# Altium schematic sheet [2] RK3399_SDRAM.SchDoc: RK3399 connection with SDRAM
size B; DocumentNumber: I; Revision: 01; SheetNumber: 2; SheetTotal: 19
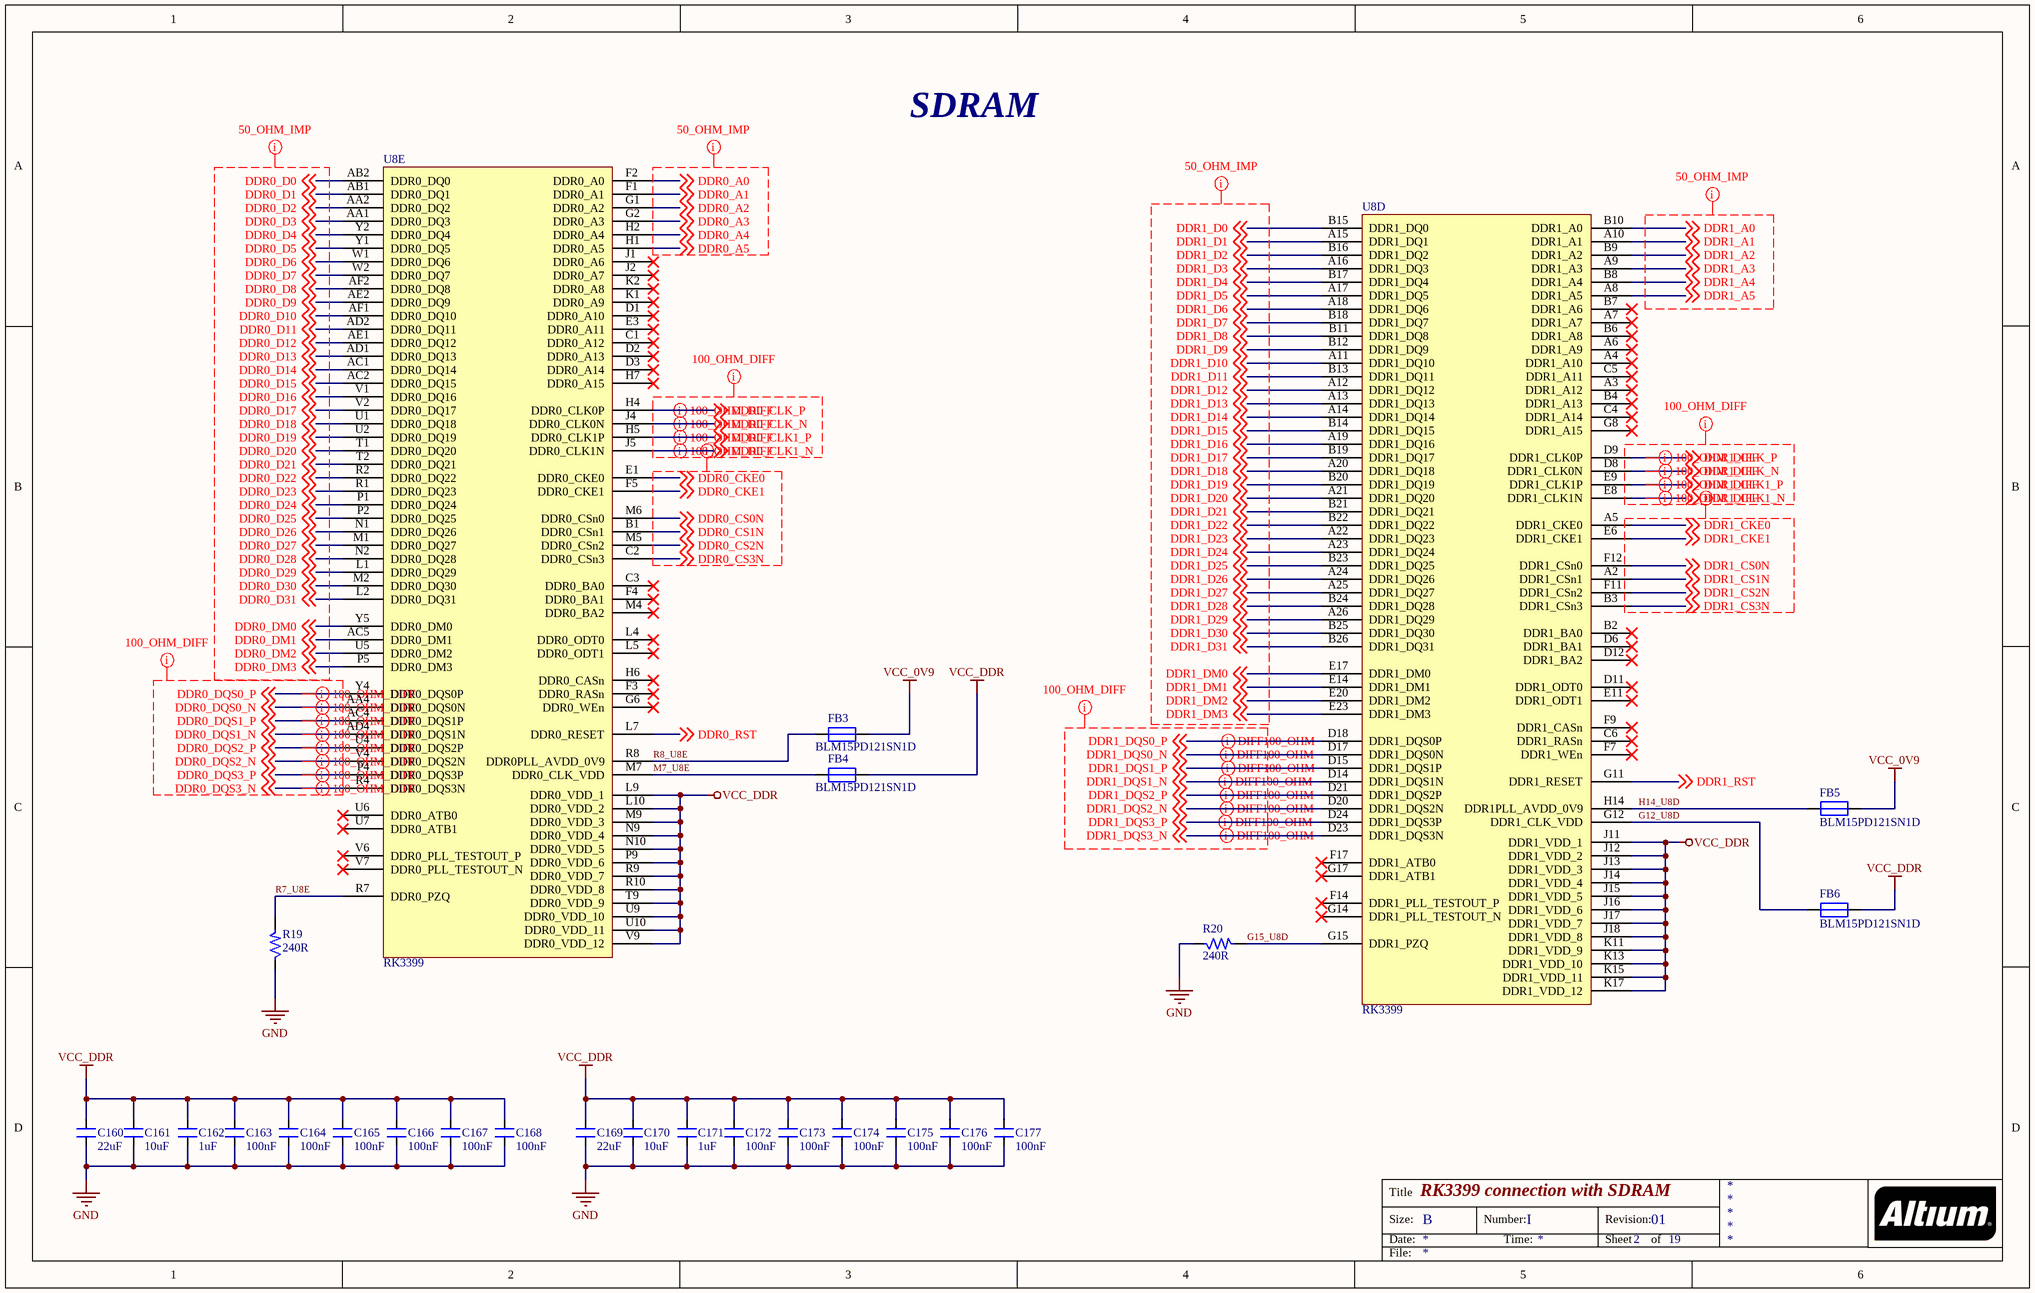
[diagram p0: [2] RK3399_SDRAM.SchDoc]

## Parts
C160  22uF  [CAP_0402]
C161  10uF  [CAP_0402]
C162  1uF  [CAP_0402]
C163  100nF  [CAP_0402]
C164  100nF  [CAP_0402]
C165  100nF  [CAP_0402]
C166  100nF  [CAP_0402]
C167  100nF  [CAP_0402]
C168  100nF  [CAP_0402]
C169  22uF  [CAP_0402]
C170  10uF  [CAP_0402]
C171  1uF  [CAP_0402]
C172  100nF  [CAP_0402]
C173  100nF  [CAP_0402]
C174  100nF  [CAP_0402]
C175  100nF  [CAP_0402]
C176  100nF  [CAP_0402]
C177  100nF  [CAP_0402]
FB3  BLM15PD121SN1D  [RES_0402]
FB4  BLM15PD121SN1D  [RES_0402]
FB5  BLM15PD121SN1D  [RES_0402]
FB6  BLM15PD121SN1D  [RES_0402]
R19  240R  [RES_0201]
R20  240R  [RES_0201]
U8  RK3399  [FBGA828_23_826X826]  (parts D,E of 24)

## Nets
GND: C160.1 C161.1 C162.1 C163.1 C164.1 C165.1 C166.1 C167.1 C168.1 C169.1 C170.1 C171.1 C172.1 C173.1 C174.1 C175.1 C176.1 C177.1 R19.1 R20.1
VCC_0V9: FB3.2 FB5.2
VCC_DDR: C160.2 C161.2 C162.2 C163.2 C164.2 C165.2 C166.2 C167.2 C168.2 C169.2 C170.2 C171.2 C172.2 C173.2 C174.2 C175.2 C176.2 C177.2 FB4.2 FB6.2 U8.J11(DDR1_VDD_1) U8.J12(DDR1_VDD_2) U8.J13(DDR1_VDD_3) U8.J14(DDR1_VDD_4) U8.J15(DDR1_VDD_5) U8.J16(DDR1_VDD_6) U8.J17(DDR1_VDD_7) U8.J18(DDR1_VDD_8) U8.K11(DDR1_VDD_9) U8.K13(DDR1_VDD_10) U8.K15(DDR1_VDD_11) U8.K17(DDR1_VDD_12) U8.L9(DDR0_VDD_1) U8.L10(DDR0_VDD_2) U8.M9(DDR0_VDD_3) U8.N9(DDR0_VDD_4) U8.N10(DDR0_VDD_5) U8.P9(DDR0_VDD_6) U8.R9(DDR0_VDD_7) U8.R10(DDR0_VDD_8) U8.T9(DDR0_VDD_9) U8.U9(DDR0_VDD_10) U8.U10(DDR0_VDD_11) U8.V9(DDR0_VDD_12)
DDR0_A0: U8.F2(DDR0_A0) ; off-sheet DDR0_A0
DDR0_A1: U8.F1(DDR0_A1) ; off-sheet DDR0_A1
DDR0_A2: U8.G1(DDR0_A2) ; off-sheet DDR0_A2
DDR0_A3: U8.G2(DDR0_A3) ; off-sheet DDR0_A3
DDR0_A4: U8.H2(DDR0_A4) ; off-sheet DDR0_A4
DDR0_A5: U8.H1(DDR0_A5) ; off-sheet DDR0_A5
DDR0_CKE0: U8.E1(DDR0_CKE0) ; off-sheet DDR0_CKE0
DDR0_CKE1: U8.F5(DDR0_CKE1) ; off-sheet DDR0_CKE1
DDR0_CLK1_N: U8.J5(DDR0_CLK1N) ; off-sheet DDR0_CLK1_N
DDR0_CLK1_P: U8.H5(DDR0_CLK1P) ; off-sheet DDR0_CLK1_P
DDR0_CLK_N: U8.J4(DDR0_CLK0N) ; off-sheet DDR0_CLK_N
DDR0_CLK_P: U8.H4(DDR0_CLK0P) ; off-sheet DDR0_CLK_P
DDR0_CS0N: U8.M6(DDR0_CSn0) ; off-sheet DDR0_CS0N
DDR0_CS1N: U8.B1(DDR0_CSn1) ; off-sheet DDR0_CS1N
DDR0_CS2N: U8.M5(DDR0_CSn2) ; off-sheet DDR0_CS2N
DDR0_CS3N: U8.C2(DDR0_CSn3) ; off-sheet DDR0_CS3N
DDR0_D0: U8.AB2(DDR0_DQ0) ; off-sheet DDR0_D0
DDR0_D1: U8.AB1(DDR0_DQ1) ; off-sheet DDR0_D1
DDR0_D2: U8.AA2(DDR0_DQ2) ; off-sheet DDR0_D2
DDR0_D3: U8.AA1(DDR0_DQ3) ; off-sheet DDR0_D3
DDR0_D4: U8.Y2(DDR0_DQ4) ; off-sheet DDR0_D4
DDR0_D5: U8.Y1(DDR0_DQ5) ; off-sheet DDR0_D5
DDR0_D6: U8.W1(DDR0_DQ6) ; off-sheet DDR0_D6
DDR0_D7: U8.W2(DDR0_DQ7) ; off-sheet DDR0_D7
DDR0_D8: U8.AF2(DDR0_DQ8) ; off-sheet DDR0_D8
DDR0_D9: U8.AE2(DDR0_DQ9) ; off-sheet DDR0_D9
DDR0_D10: U8.AF1(DDR0_DQ10) ; off-sheet DDR0_D10
DDR0_D11: U8.AD2(DDR0_DQ11) ; off-sheet DDR0_D11
DDR0_D12: U8.AE1(DDR0_DQ12) ; off-sheet DDR0_D12
DDR0_D13: U8.AD1(DDR0_DQ13) ; off-sheet DDR0_D13
DDR0_D14: U8.AC1(DDR0_DQ14) ; off-sheet DDR0_D14
DDR0_D15: U8.AC2(DDR0_DQ15) ; off-sheet DDR0_D15
DDR0_D16: U8.V1(DDR0_DQ16) ; off-sheet DDR0_D16
DDR0_D17: U8.V2(DDR0_DQ17) ; off-sheet DDR0_D17
DDR0_D18: U8.U1(DDR0_DQ18) ; off-sheet DDR0_D18
DDR0_D19: U8.U2(DDR0_DQ19) ; off-sheet DDR0_D19
DDR0_D20: U8.T1(DDR0_DQ20) ; off-sheet DDR0_D20
DDR0_D21: U8.T2(DDR0_DQ21) ; off-sheet DDR0_D21
DDR0_D22: U8.R2(DDR0_DQ22) ; off-sheet DDR0_D22
DDR0_D23: U8.R1(DDR0_DQ23) ; off-sheet DDR0_D23
DDR0_D24: U8.P1(DDR0_DQ24) ; off-sheet DDR0_D24
DDR0_D25: U8.P2(DDR0_DQ25) ; off-sheet DDR0_D25
DDR0_D26: U8.N1(DDR0_DQ26) ; off-sheet DDR0_D26
DDR0_D27: U8.M1(DDR0_DQ27) ; off-sheet DDR0_D27
DDR0_D28: U8.N2(DDR0_DQ28) ; off-sheet DDR0_D28
DDR0_D29: U8.L1(DDR0_DQ29) ; off-sheet DDR0_D29
DDR0_D30: U8.M2(DDR0_DQ30) ; off-sheet DDR0_D30
DDR0_D31: U8.L2(DDR0_DQ31) ; off-sheet DDR0_D31
DDR0_DM0: U8.Y5(DDR0_DM0) ; off-sheet DDR0_DM0
DDR0_DM1: U8.AC5(DDR0_DM1) ; off-sheet DDR0_DM1
DDR0_DM2: U8.U5(DDR0_DM2) ; off-sheet DDR0_DM2
DDR0_DM3: U8.P5(DDR0_DM3) ; off-sheet DDR0_DM3
DDR0_DQS0_N: U8.AA4(DDR0_DQS0N) ; off-sheet DDR0_DQS0_N
DDR0_DQS0_P: U8.Y4(DDR0_DQS0P) ; off-sheet DDR0_DQS0_P
DDR0_DQS1_N: U8.AD4(DDR0_DQS1N) ; off-sheet DDR0_DQS1_N
DDR0_DQS1_P: U8.AC4(DDR0_DQS1P) ; off-sheet DDR0_DQS1_P
DDR0_DQS2_N: U8.V4(DDR0_DQS2N) ; off-sheet DDR0_DQS2_N
DDR0_DQS2_P: U8.U4(DDR0_DQS2P) ; off-sheet DDR0_DQS2_P
DDR0_DQS3_N: U8.R4(DDR0_DQS3N) ; off-sheet DDR0_DQS3_N
DDR0_DQS3_P: U8.P4(DDR0_DQS3P) ; off-sheet DDR0_DQS3_P
DDR0_RST: U8.L7(DDR0_RESET) ; off-sheet DDR0_RST
DDR1_A0: U8.B10(DDR1_A0) ; off-sheet DDR1_A0
DDR1_A1: U8.A10(DDR1_A1) ; off-sheet DDR1_A1
DDR1_A2: U8.B9(DDR1_A2) ; off-sheet DDR1_A2
DDR1_A3: U8.A9(DDR1_A3) ; off-sheet DDR1_A3
DDR1_A4: U8.B8(DDR1_A4) ; off-sheet DDR1_A4
DDR1_A5: U8.A8(DDR1_A5) ; off-sheet DDR1_A5
DDR1_CKE0: U8.A5(DDR1_CKE0) ; off-sheet DDR1_CKE0
DDR1_CKE1: U8.E6(DDR1_CKE1) ; off-sheet DDR1_CKE1
DDR1_CLK1_N: U8.E8(DDR1_CLK1N) ; off-sheet DDR1_CLK1_N
DDR1_CLK1_P: U8.E9(DDR1_CLK1P) ; off-sheet DDR1_CLK1_P
DDR1_CLK_N: U8.D8(DDR1_CLK0N) ; off-sheet DDR1_CLK_N
DDR1_CLK_P: U8.D9(DDR1_CLK0P) ; off-sheet DDR1_CLK_P
DDR1_CS0N: U8.F12(DDR1_CSn0) ; off-sheet DDR1_CS0N
DDR1_CS1N: U8.A2(DDR1_CSn1) ; off-sheet DDR1_CS1N
DDR1_CS2N: U8.F11(DDR1_CSn2) ; off-sheet DDR1_CS2N
DDR1_CS3N: U8.B3(DDR1_CSn3) ; off-sheet DDR1_CS3N
DDR1_D0: U8.B15(DDR1_DQ0) ; off-sheet DDR1_D0
DDR1_D1: U8.A15(DDR1_DQ1) ; off-sheet DDR1_D1
DDR1_D2: U8.B16(DDR1_DQ2) ; off-sheet DDR1_D2
DDR1_D3: U8.A16(DDR1_DQ3) ; off-sheet DDR1_D3
DDR1_D4: U8.B17(DDR1_DQ4) ; off-sheet DDR1_D4
DDR1_D5: U8.A17(DDR1_DQ5) ; off-sheet DDR1_D5
DDR1_D6: U8.A18(DDR1_DQ6) ; off-sheet DDR1_D6
DDR1_D7: U8.B18(DDR1_DQ7) ; off-sheet DDR1_D7
DDR1_D8: U8.B11(DDR1_DQ8) ; off-sheet DDR1_D8
DDR1_D9: U8.B12(DDR1_DQ9) ; off-sheet DDR1_D9
DDR1_D10: U8.A11(DDR1_DQ10) ; off-sheet DDR1_D10
DDR1_D11: U8.B13(DDR1_DQ11) ; off-sheet DDR1_D11
DDR1_D12: U8.A12(DDR1_DQ12) ; off-sheet DDR1_D12
DDR1_D13: U8.A13(DDR1_DQ13) ; off-sheet DDR1_D13
DDR1_D14: U8.A14(DDR1_DQ14) ; off-sheet DDR1_D14
DDR1_D15: U8.B14(DDR1_DQ15) ; off-sheet DDR1_D15
DDR1_D16: U8.A19(DDR1_DQ16) ; off-sheet DDR1_D16
DDR1_D17: U8.B19(DDR1_DQ17) ; off-sheet DDR1_D17
DDR1_D18: U8.A20(DDR1_DQ18) ; off-sheet DDR1_D18
DDR1_D19: U8.B20(DDR1_DQ19) ; off-sheet DDR1_D19
DDR1_D20: U8.A21(DDR1_DQ20) ; off-sheet DDR1_D20
DDR1_D21: U8.B21(DDR1_DQ21) ; off-sheet DDR1_D21
DDR1_D22: U8.B22(DDR1_DQ22) ; off-sheet DDR1_D22
DDR1_D23: U8.A22(DDR1_DQ23) ; off-sheet DDR1_D23
DDR1_D24: U8.A23(DDR1_DQ24) ; off-sheet DDR1_D24
DDR1_D25: U8.B23(DDR1_DQ25) ; off-sheet DDR1_D25
DDR1_D26: U8.A24(DDR1_DQ26) ; off-sheet DDR1_D26
DDR1_D27: U8.A25(DDR1_DQ27) ; off-sheet DDR1_D27
DDR1_D28: U8.B24(DDR1_DQ28) ; off-sheet DDR1_D28
DDR1_D29: U8.A26(DDR1_DQ29) ; off-sheet DDR1_D29
DDR1_D30: U8.B25(DDR1_DQ30) ; off-sheet DDR1_D30
DDR1_D31: U8.B26(DDR1_DQ31) ; off-sheet DDR1_D31
DDR1_DM0: U8.E17(DDR1_DM0) ; off-sheet DDR1_DM0
DDR1_DM1: U8.E14(DDR1_DM1) ; off-sheet DDR1_DM1
DDR1_DM2: U8.E20(DDR1_DM2) ; off-sheet DDR1_DM2
DDR1_DM3: U8.E23(DDR1_DM3) ; off-sheet DDR1_DM3
DDR1_DQS0_N: U8.D17(DDR1_DQS0N) ; off-sheet DDR1_DQS0_N
DDR1_DQS0_P: U8.D18(DDR1_DQS0P) ; off-sheet DDR1_DQS0_P
DDR1_DQS1_N: U8.D14(DDR1_DQS1N) ; off-sheet DDR1_DQS1_N
DDR1_DQS1_P: U8.D15(DDR1_DQS1P) ; off-sheet DDR1_DQS1_P
DDR1_DQS2_N: U8.D20(DDR1_DQS2N) ; off-sheet DDR1_DQS2_N
DDR1_DQS2_P: U8.D21(DDR1_DQS2P) ; off-sheet DDR1_DQS2_P
DDR1_DQS3_N: U8.D23(DDR1_DQS3N) ; off-sheet DDR1_DQS3_N
DDR1_DQS3_P: U8.D24(DDR1_DQS3P) ; off-sheet DDR1_DQS3_P
DDR1_RST: U8.G11(DDR1_RESET) ; off-sheet DDR1_RST
G12_U8D: FB6.1 U8.G12(DDR1_CLK_VDD)
G15_U8D: R20.2 U8.G15(DDR1_PZQ)
H14_U8D: FB5.1 U8.H14(DDR1PLL_AVDD_0V9)
M7_U8E: FB4.1 U8.M7(DDR0_CLK_VDD)
R7_U8E: R19.2 U8.R7(DDR0_PZQ)
R8_U8E: FB3.1 U8.R8(DDR0PLL_AVDD_0V9)

Not connected (* = marked no-connect by the designer): U8 A3(DDR1_A12)* A4(DDR1_A10)* A6(DDR1_A9)* A7(DDR1_A7)* B2(DDR1_BA0)* B4(DDR1_A13)* B6(DDR1_A8)* B7(DDR1_A6)* C1(DDR0_A12)* C3(DDR0_BA0)* C4(DDR1_A14)* C5(DDR1_A11)* C6(DDR1_RASn)* D1(DDR0_A10)* D2(DDR0_A13)* D3(DDR0_A14)* D6(DDR1_BA1)* D11(DDR1_ODT0)* D12(DDR1_BA2)* E3(DDR0_A11)* E11(DDR1_ODT1)* F3(DDR0_RASn)* F4(DDR0_BA1)* F7(DDR1_WEn)* F9(DDR1_CASn)* F14(DDR1_PLL_TESTOUT_P)* F17(DDR1_ATB0)* G6(DDR0_WEn)* G8(DDR1_A15)* G14(DDR1_PLL_TESTOUT_N)* G17(DDR1_ATB1)* H6(DDR0_CASn)* H7(DDR0_A15)* J1(DDR0_A6)* J2(DDR0_A7)* K1(DDR0_A9)* K2(DDR0_A8)* L4(DDR0_ODT0)* L5(DDR0_ODT1)* M4(DDR0_BA2)* U6(DDR0_ATB0)* U7(DDR0_ATB1)* V6(DDR0_PLL_TESTOUT_P)* V7(DDR0_PLL_TESTOUT_N)*

## Layout directives
net class 50_OHM_IMP: DDR1_D0, DDR1_D1, DDR1_D2, DDR1_D3, DDR1_D4, DDR1_D5, DDR1_D6, DDR1_D7, DDR1_D8, DDR1_D9, DDR1_D10, DDR1_D11, DDR1_D12, DDR1_D13, DDR1_D14, DDR1_D15, DDR1_D16, DDR1_D17, DDR1_D18, DDR1_D19, DDR1_D20, DDR1_D21, DDR1_D22, DDR1_D23, DDR1_D24, DDR1_D25, DDR1_D26, DDR1_D27, DDR1_D28, DDR1_D29, DDR1_D30, DDR1_D31, DDR1_DM0, DDR1_DM1, DDR1_DM2, DDR1_DM3
differential pair; differential pair class DIIF_100_OHM: DDR1_DQS0_N, DDR1_DQS0_P, DDR1_DQS1_N, DDR1_DQS1_P, DDR1_DQS2_N, DDR1_DQS2_P, DDR1_DQS3_N, DDR1_DQS3_P
mark named 50_OHM_IMP: DDR0_A0, DDR0_A1, DDR0_A2, DDR0_A3, DDR0_A4, DDR0_A5, DDR0_CKE0, DDR0_CKE1, DDR0_CS0N, DDR0_CS1N, DDR0_CS2N, DDR0_CS3N, DDR0_D0, DDR0_D1, DDR0_D2, DDR0_D3, DDR0_D4, DDR0_D5, DDR0_D6, DDR0_D7, DDR0_D8, DDR0_D9, DDR0_D10, DDR0_D11, DDR0_D12, DDR0_D13, DDR0_D14, DDR0_D15, DDR0_D16, DDR0_D17, DDR0_D18, DDR0_D19, DDR0_D20, DDR0_D21, DDR0_D22, DDR0_D23, DDR0_D24, DDR0_D25, DDR0_D26, DDR0_D27, DDR0_D28, DDR0_D29, DDR0_D30, DDR0_D31, DDR0_DM0, DDR0_DM1, DDR0_DM2, DDR0_DM3, DDR1_A0, DDR1_A1, DDR1_A2, DDR1_A3, DDR1_A4, DDR1_A5, DDR1_CKE0, DDR1_CKE1, DDR1_CS0N, DDR1_CS1N, DDR1_CS2N, DDR1_CS3N
differential pair: DDR0_CLK1_N, DDR0_CLK1_P, DDR0_CLK_N, DDR0_CLK_P, DDR0_DQS0_N, DDR0_DQS0_P, DDR0_DQS1_N, DDR0_DQS1_P, DDR0_DQS2_N, DDR0_DQS2_P, DDR0_DQS3_N, DDR0_DQS3_P, DDR1_CLK1_N, DDR1_CLK1_P, DDR1_CLK_N, DDR1_CLK_P
mark named 100_OHM_DIFF: DDR0_CLK1_N, DDR0_CLK1_P, DDR0_CLK_N, DDR0_CLK_P, DDR0_DQS0_N, DDR0_DQS0_P, DDR0_DQS1_N, DDR0_DQS1_P, DDR0_DQS2_N, DDR0_DQS2_P, DDR0_DQS3_N, DDR0_DQS3_P, DDR1_CLK1_N, DDR1_CLK1_P, DDR1_CLK_N, DDR1_CLK_P, DDR1_DQS0_N, DDR1_DQS0_P, DDR1_DQS1_N, DDR1_DQS1_P, DDR1_DQS2_N, DDR1_DQS2_P, DDR1_DQS3_N, DDR1_DQS3_P

## Notes on the sheet
- SDRAM
- Title
- Size:
- Date:
- B
- Number:
- Time:
- Revision:
- Sheet
- of
- File:

## Library data of the parts
C160 C169 = CAP_22uF-6.3V-20%-0402: 22µF ±20% 6.3V Ceramic Capacitor X5R 0402 (1005 Metric) /; Manufacturer: Murata Electronics; Manufacturer Part Number: CL05A226MQ5N6J8; Case/Package: 0402; Supplier-1: Digikey
C161 C170 = CAP_10uF-10V-20%-0402: 10µF ±20% 10V Ceramic Capacitor X5R 0402 (1005 Metric) /; Manufacturer Part Number: CL05A106MP5NUNC; Manufacturer: Samsung Electro-Mechanics; Case/Package: 0402; Supplier-1: Digikey
C162 C171 = CAP_1uF-10V-10%-0402: 1µF ±10% 10V Ceramic Capacitor X6S 0402 (1005 Metric) /; Manufacturer: Murata Electronics; Manufacturer Part Number: GRT155C81A105KE01D; Case/Package: 0402; Supplier-1: Digikey
C163-C168 C172-C177 = CAP_100nF-10V-10%-0402: 0.1µF ±10% 10V Ceramic Capacitor X7R 0402 (1005 Metric) /; Manufacturer: Yageo; Manufacturer Part Number: CC0402KRX7R6BB104; Case/Package: 0402; Supplier-1: Digikey
FB3-FB6 = FB_120R-1.3A-100Mhz-0402: 120 Ohms @ 100MHz 1 Power Line Ferrite Bead 0402 (1005 Metric) 1.3A 90mOhm; Manufacturer: Murata Electronics; Mnaufacturer Part Number: BLM15PD121SN1D; Case/Package: 0402; Supplier-1: Digikey
R19 R20 = RES_240R-0.05W-1%-0201: 240 Ohms ±1% 0.05W, 1/20W Chip Resistor 0201 (0603 Metric) Thick Film /; Manufacturer: Yageo; Manufacturer Part Number: RC0201FR-07240RL; Case/Package: 0201; Supplier-1: Digikey
U8 = IC_RK3399-FCBGA828: RK3399 is a low power, high performance processor for computing, personal mobile.; Manufacturer: Rockchip; Manufacturer Part Number: RK3399; Case/Package: FCBGA828; Supplier-1: Rockchip